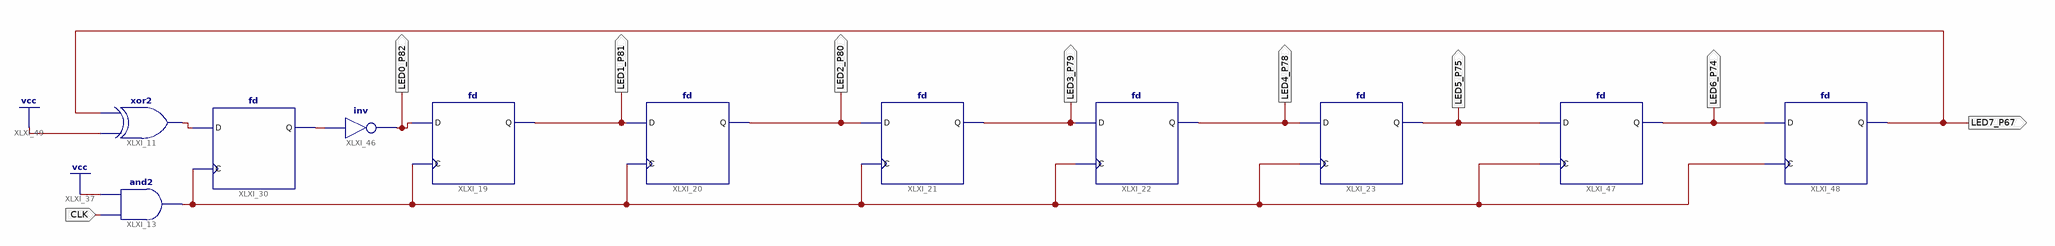
[diagram p0: schematic sheet 1]
// Xilinx ISE schematic lab7t.sch (spartan6) as structural Verilog: 11 symbols, 9 ports
module lab7t (
  input  CLK,
  output LED1_P81,
  output LED2_P80,
  output LED3_P79,
  output LED4_P78,
  output LED7_P67,
  output LED0_P82,
  output LED5_P75,
  output LED6_P74
);

  wire XLXN_29, XLXN_41, XLXN_87;

  fd XLXI_22 (.C(XLXN_41), .D(LED3_P79), .Q(LED4_P78));
  fd XLXI_20 (.C(XLXN_41), .D(LED1_P81), .Q(LED2_P80));
  fd XLXI_21 (.C(XLXN_41), .D(LED2_P80), .Q(LED3_P79));
  fd XLXI_23 (.C(XLXN_41), .D(LED4_P78), .Q(LED5_P75));
  fd XLXI_30 (.C(XLXN_41), .D(XLXN_29), .Q(XLXN_87));
  xor XLXI_11 (XLXN_29, 1'b1, LED7_P67);
  fd XLXI_19 (.C(XLXN_41), .D(LED0_P82), .Q(LED1_P81));
  and XLXI_13 (XLXN_41, CLK, 1'b1);
  not XLXI_46 (LED0_P82, XLXN_87);
  fd XLXI_47 (.C(XLXN_41), .D(LED5_P75), .Q(LED6_P74));
  fd XLXI_48 (.C(XLXN_41), .D(LED6_P74), .Q(LED7_P67));
endmodule
